# Altium schematic sheet LED_bars.SchDoc
size A; SheetNumber: 1; SheetTotal: 1
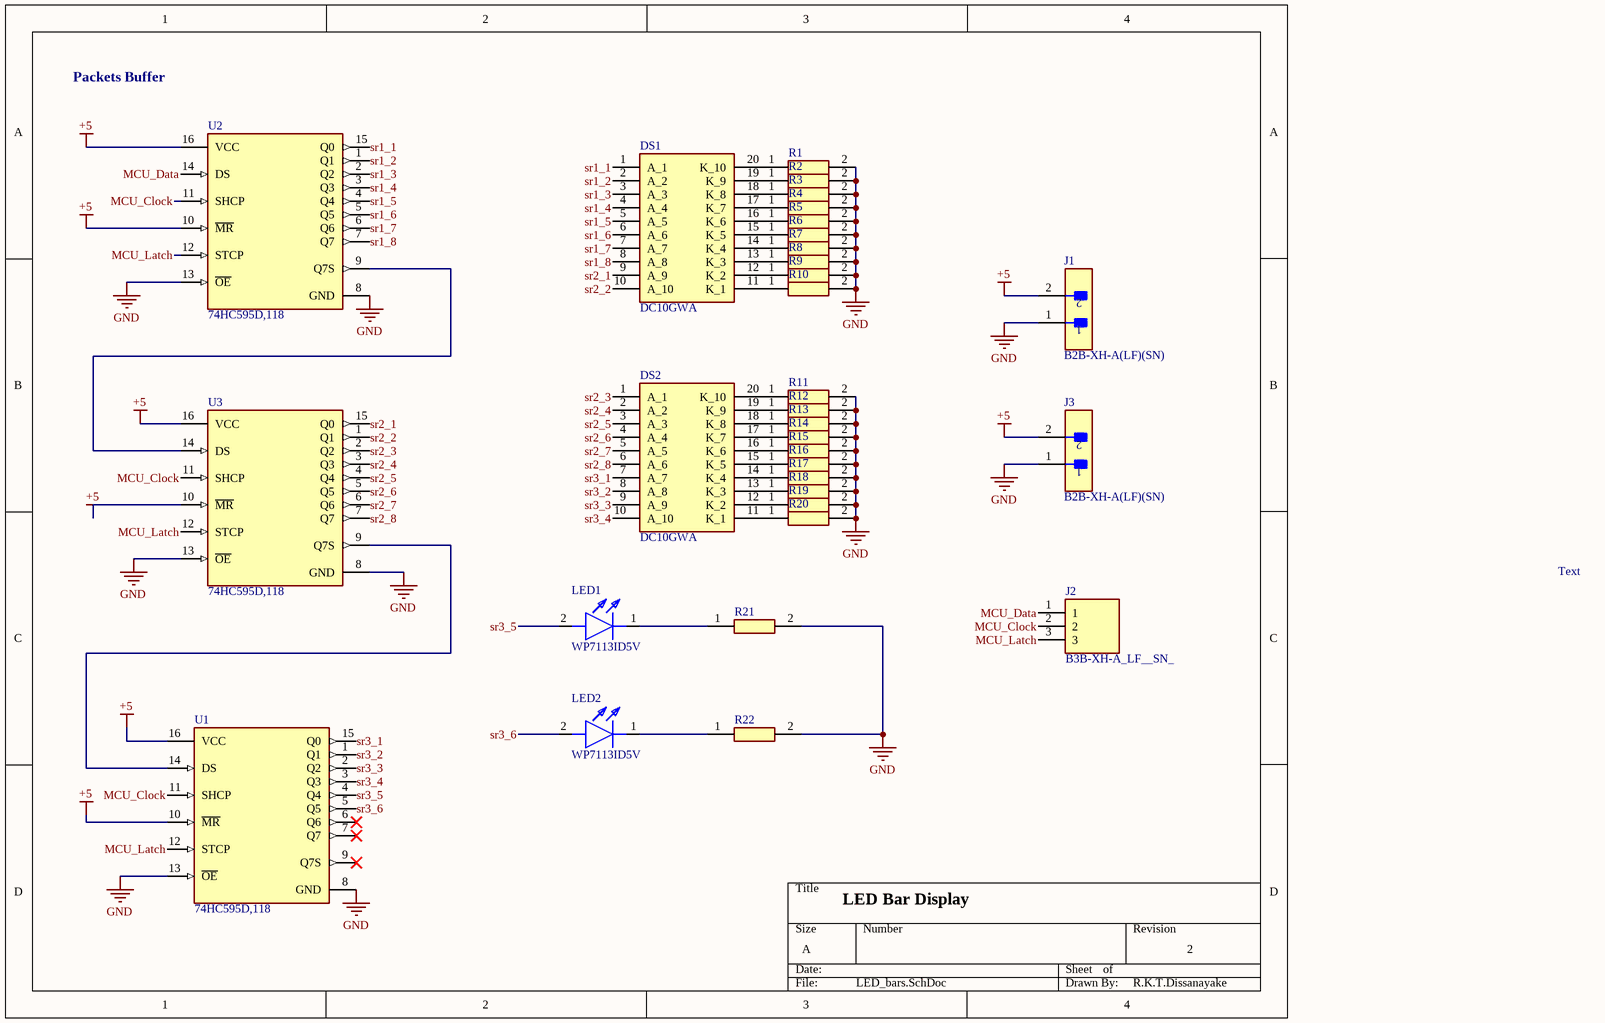
[diagram p0: LED_bars.SchDoc]

## Parts
DS1  DC10GWA  [DIPS750W75P254L2540H825Q20N]
DS2  DC10GWA  [DIPS750W75P254L2540H825Q20N]
J1  B2B-XH-A(LF)(SN)  [FP-B2B-XH-A_LF_SN-MFG]
J2  B3B-XH-A_LF__SN_  [B3BXHALFSN]
J3  B2B-XH-A(LF)(SN)  [FP-B2B-XH-A_LF_SN-MFG]
LED1  WP7113ID5V  [WP7113ID5V]
LED2  WP7113ID5V  [WP7113ID5V]
R1  330  [RESC3126X65N]  (value not drawn)
R2  RC1210FR-07330RL  [RESC3126X65N]  (value not drawn)
R3  330  [RESC3126X65N]  (value not drawn)
R4  RC1210FR-07330RL  [RESC3126X65N]  (value not drawn)
R5  330  [RESC3126X65N]  (value not drawn)
R6  RC1210FR-07330RL  [RESC3126X65N]  (value not drawn)
R7  330  [RESC3126X65N]  (value not drawn)
R8  RC1210FR-07330RL  [RESC3126X65N]  (value not drawn)
R9  330  [RESC3126X65N]  (value not drawn)
R10  330  [RESC3126X65N]  (value not drawn)
R11  330  [RESC3126X65N]  (value not drawn)
R12  330  [RESC3126X65N]  (value not drawn)
R13  330  [RESC3126X65N]  (value not drawn)
R14  330  [RESC3126X65N]  (value not drawn)
R15  330  [RESC3126X65N]  (value not drawn)
R16  330  [RESC3126X65N]  (value not drawn)
R17  330  [RESC3126X65N]  (value not drawn)
R18  330  [RESC3126X65N]  (value not drawn)
R19  RC1210FR-07330RL  [RESC3126X65N]  (value not drawn)
R20  330  [RESC3126X65N]  (value not drawn)
R21  330  [RESC3126X65N]  (value not drawn)
R22  330  [RESC3126X65N]  (value not drawn)
U1  74HC595D,118  [FP-SOT109-1-IPC_C]
U2  74HC595D,118  [FP-SOT109-1-IPC_C]
U3  74HC595D,118  [FP-SOT109-1-IPC_C]

## Nets
+5: J1.2 J3.2 U1.10(~{MR}) U1.16(VCC) U2.10(~{MR}) U2.16(VCC) U3.10(~{MR}) U3.16(VCC)
GND: J1.1 J3.1 R1.2 R2.2 R3.2 R4.2 R5.2 R6.2 R7.2 R8.2 R9.2 R10.2 R11.2 R12.2 R13.2 R14.2 R15.2 R16.2 R17.2 R18.2 R19.2 R20.2 R21.2 R22.2 U1.8(GND) U1.13(~{OE}) U2.8(GND) U2.13(~{OE}) U3.8(GND) U3.13(~{OE})
MCU_Clock: J2.2 U1.11(SHCP) U2.11(SHCP) U3.11(SHCP)
MCU_Data: J2.1 U2.14(DS)
MCU_Latch: J2.3 U1.12(STCP) U2.12(STCP) U3.12(STCP)
sr1_1: DS1.1(A_1) U2.15(Q0)
sr1_2: DS1.2(A_2) U2.1(Q1)
sr1_3: DS1.3(A_3) U2.2(Q2)
sr1_4: DS1.4(A_4) U2.3(Q3)
sr1_5: DS1.5(A_5) U2.4(Q4)
sr1_6: DS1.6(A_6) U2.5(Q5)
sr1_7: DS1.7(A_7) U2.6(Q6)
sr1_8: DS1.8(A_8) U2.7(Q7)
sr2_1: DS1.9(A_9) U3.15(Q0)
sr2_2: DS1.10(A_10) U3.1(Q1)
sr2_3: DS2.1(A_1) U3.2(Q2)
sr2_4: DS2.2(A_2) U3.3(Q3)
sr2_5: DS2.3(A_3) U3.4(Q4)
sr2_6: DS2.4(A_4) U3.5(Q5)
sr2_7: DS2.5(A_5) U3.6(Q6)
sr2_8: DS2.6(A_6) U3.7(Q7)
sr3_1: DS2.7(A_7) U1.15(Q0)
sr3_2: DS2.8(A_8) U1.1(Q1)
sr3_3: DS2.9(A_9) U1.2(Q2)
sr3_4: DS2.10(A_10) U1.3(Q3)
sr3_5: LED1.2(A) U1.4(Q4)
sr3_6: LED2.2(A) U1.5(Q5)
NetDS1_11: DS1.11(K_1) R10.1
NetDS1_12: DS1.12(K_2) R9.1
NetDS1_13: DS1.13(K_3) R8.1
NetDS1_14: DS1.14(K_4) R7.1
NetDS1_15: DS1.15(K_5) R6.1
NetDS1_16: DS1.16(K_6) R5.1
NetDS1_17: DS1.17(K_7) R4.1
NetDS1_18: DS1.18(K_8) R3.1
NetDS1_19: DS1.19(K_9) R2.1
NetDS1_20: DS1.20(K_10) R1.1
NetDS2_11: DS2.11(K_1) R20.1
NetDS2_12: DS2.12(K_2) R19.1
NetDS2_13: DS2.13(K_3) R18.1
NetDS2_14: DS2.14(K_4) R17.1
NetDS2_15: DS2.15(K_5) R16.1
NetDS2_16: DS2.16(K_6) R15.1
NetDS2_17: DS2.17(K_7) R14.1
NetDS2_18: DS2.18(K_8) R13.1
NetDS2_19: DS2.19(K_9) R12.1
NetDS2_20: DS2.20(K_10) R11.1
NetLED1_1: LED1.1(K) R21.1
NetLED2_1: LED2.1(K) R22.1
NetU1_14: U1.14(DS) U3.9(Q7S)
NetU2_9: U2.9(Q7S) U3.14(DS)

Not connected (* = marked no-connect by the designer): U1 6(Q6)* 7(Q7)* 9(Q7S)*

## Notes on the sheet
- Packets Buffer
- Text
- LED Bar Display
- 2
- R.K.T.Dissanayake

## Library data of the parts
DS1 DS2 = DC10GWA: Display; Manufacturer_Name: Kingbright; Datasheet Link: http://www.us.kingbright.com/images/catalog/SPEC/DC10GWA.pdf; Height: 8.25mm; Manufacturer_Part_Number: DC10GWA; Mouser Part Number: 604-DC10GWA; Mouser Price/Stock: https://www.mouser.co.uk/ProductDetail/Kingbright/DC10GWA?qs=E09Sz5t5voWFSEBebdyzXA%3D%3D
J1 J3 = CMP-2000-05888-3: CONN HEADER VERT 2POS 2.5MM; Current Rating: 3A; Voltage Rating: 250V; Number of Contacts: 2; Contact Resistance: 20mR; Wire/Cable Gauge: 22AWG; Insulation Resistance: 1GR; Connector Type: Male Pin; Packaging: Bulk; Contact Material: Brass; Lead Free: Lead Free; Orientation: Straight; Contact Plating: Tin; Max Current Rating: 3A; Termination: Solder; Fastening Type: Detent; Depth: 5.75mm; Housing Material: Polyamide; REACH SVHC: No SVHC; Series: XH; Voltage Rating (AC): 250V; Number of Positions: 2; Color: Natural; Contact Type: Male Pin; Max Voltage Rating (DC): 250V; Pitch: 2.5mm; Lead Pitch: 2.5mm; Mount: Through Hole; Max Operating Temperature: 85°C; Length: 7.4mm; Max Voltage Rating (AC): 250V; Min Operating Temperature: -25°C; Number of Rows: 1; Housing Color: White
J2 = B3B-XH-A_LF__SN_: Connector; Manufacturer_Name: JST (JAPAN SOLDERLESS TERMINALS); Manufacturer_Part_Number: B3B-XH-A(LF)(SN); Datasheet Link: https://datasheet.lcsc.com/szlcsc/1812131720_JST-Sales-America-B3B-XH-A-LF-SN_C144394.pdf; Height: 7mm; Mouser Part Number: 306-B3BXHALFSNP; Mouser Price/Stock: https://www.mouser.co.uk/ProductDetail/JST-Commercial/B3B-XH-ALFSN?qs=cdbOS8ANM9BVkoboCCIEMQ%3D%3D; Arrow Part Number: B3B-XH-A(LF)(SN); Arrow Price/Stock: https://www.arrow.com/en/products/b3b-xh-a-lf-sn/jst-manufacturing?utm_currency=USD&region=europe
LED1 LED2 = WP7113ID5V: LED; Manufacturer_Name: Kingbright; Datasheet Link: https://www.kingbrightusa.com/images/catalog/SPEC/WP7113ID5V.pdf; Height: 9.85mm; Manufacturer_Part_Number: WP7113ID5V; Mouser Part Number: 604-WP7113ID5V; Mouser Price/Stock: https://www.mouser.co.uk/ProductDetail/Kingbright/WP7113ID5V?qs=58z0TXQGVSQgkIxR0kd%2F5Q%3D%3D; Arrow Part Number: WP7113ID5V; Arrow Price/Stock: https://www.arrow.com/en/products/wp7113id5v/kingbright?utm_currency=USD&region=nac
R1-R22 = RC1210FR-07330RL: Resistor; Manufacturer_Name: Yageo Group; Datasheet Link: https://www.yageogroup.com/content/datasheet/asset/file/PYU-RC_GROUP_51_ROHS_L; Height: 0.65mm; Manufacturer_Part_Number: RC1210FR-07330RL
U1-U3 = CMP-14351-000006-1: IC SHIFT REGISTER 8BIT 16SOIC; RoHS Compliant: Yes